# Altium schematic sheet acoplador_50_50.SchDoc
size A; SheetNumber: 2; SheetTotal: 2
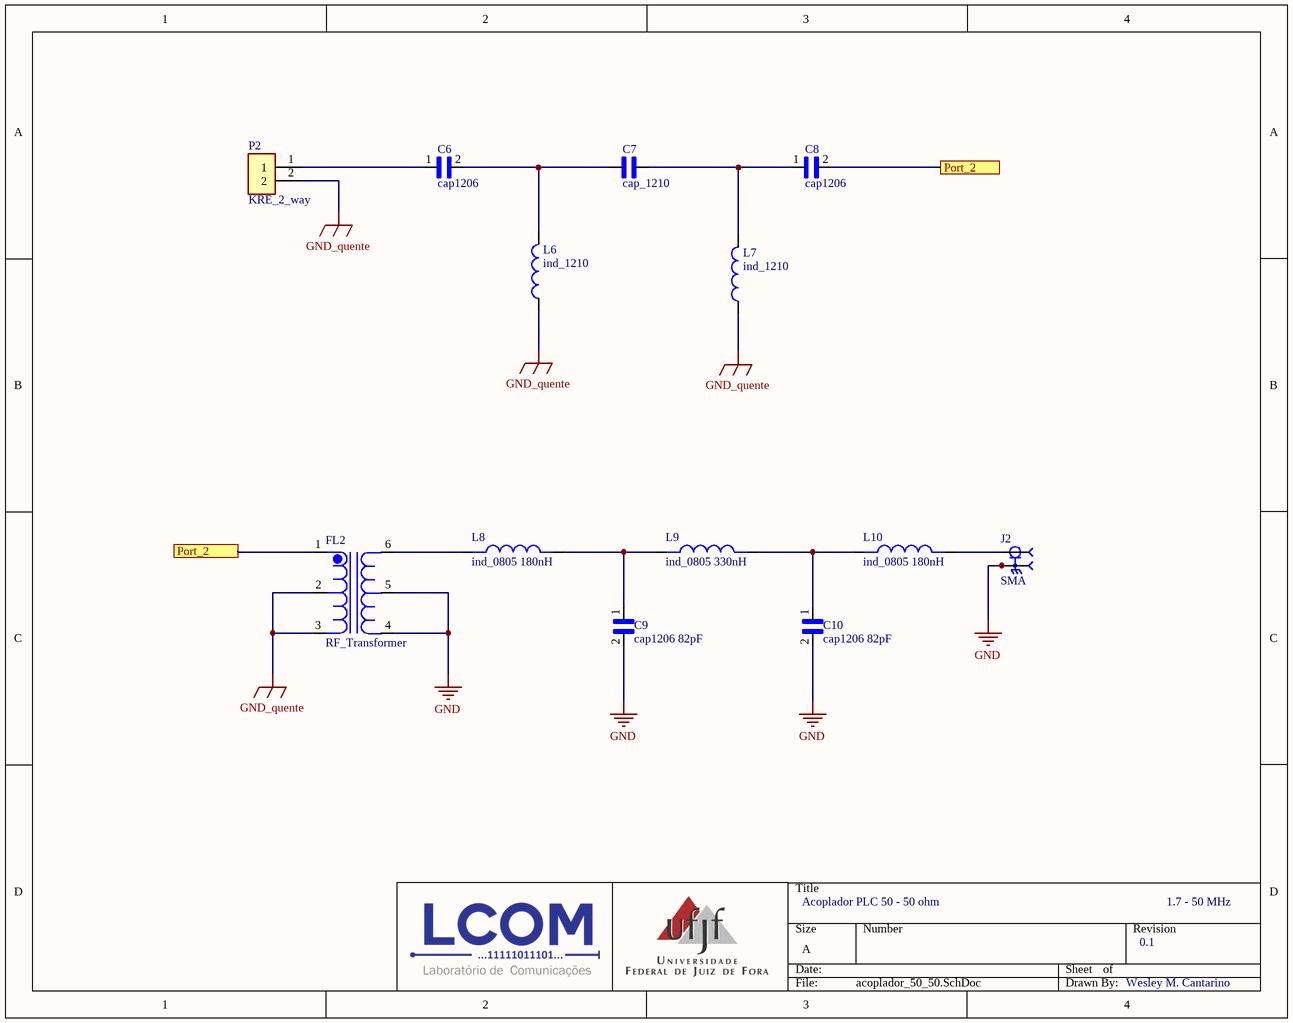
[diagram p0: acoplador_50_50.SchDoc]

## Parts
C6  cap1206  [CAPC3216X160N]
C7  cap_1210  [CAPC3225X200N]
C8  cap1206  [CAPC3216X160N]
C9  cap1206 82pF  [CAPC3216X160N]
C10  cap1206 82pF  [CAPC3216X160N]
FL2  RF_Transformer  [FIL_KA4909-AL]
J2  SMA  [JOHNSON_142-0701-201]
L6  ind_1210  [INDC3225X120N]
L7  ind_1210  [INDC3225X120N]
L8  ind_0805 180nH  [IND_ASMCI-0805-4R7M-T]
L9  ind_0805 330nH  [IND_ASMCI-0805-4R7M-T]
L10  ind_0805 180nH  [IND_ASMCI-0805-4R7M-T]
P2  KRE_2_way  [TE_282837-2]

## Ports
Port_2

## Nets
GND: C9.2 C10.2 FL2.4 FL2.5 J2.2 J2.3 J2.4 J2.5
GND_quente: FL2.2 FL2.3 L6.1 L7.1 P2.2
Port_2: C8.2 FL2.1 ; port Port_2
NetC6_1: C6.1 P2.1
NetC6_2: C6.2 C7.1 L6.2
NetC7_2: C7.2 C8.1 L7.2
NetC9_1: C9.1 L8.2 L9.1
NetC10_1: C10.1 L9.2 L10.1
NetFL2_6: FL2.6 L8.1
NetJ2_1: J2.1 L10.2

## Notes on the sheet
- Acoplador PLC 50 - 50 ohm
- 1.7 - 50 MHz
- 0.1
- Wesley M. Cantarino

## Library data of the parts
C6 C8-C10 = cap1206: MF: {'manufacturer': u'Syfer'}; MP: 1206J2K00820JCT; Package: None; Availability: Unavailable; Value: *; Price: None
C7 = cap_1210: CAPACITOR, X7T, 33NF; Capacitance:33000pF; Capacitance Tolerance:Â± 10%; Dielectric Characteristic:X7T; Voltage Rating:630V; Capacitor Case Style:1210 [3225 Metric]; Operating Temperature Min:-55Â°C; Operating Temperature Max:125Â°C; Packaging:Cut Tape; SVHC:No SVHC (19-Dec-2012); Capacitor Terminals:SMD; Operating Temperature Range:-55Â°C to +125Â°C; MF: {'manufacturer': u'Murata Electronics'}; MP: GR332DD72J333KW01L; Package: None; Availability: Unavailable; Value: *; Price: None
FL2 = RF_Transformer: Bias Injection Choke PWB 1.5 AL 30k 300M 1:1.5; MF: {'manufacturer': u'Coilcraft'}; MP: KA4909-AL; Package: None; Availability: Unavailable; Value: *; Price: None
J2 = SMA: Johnson Components 142-0701-201 / Conn Recept Straight Pcb .155""; MF: {'manufacturer': u'Cinch Connectivity Solutions Johnson'}; Package: None; Availability: Unavailable; Value: *; MP: 142-0701-201; Price: None
L6 L7 = ind_1210: Ind Metal Alloy Shielded 1.5uH 20% 1MHz Powdered Iron 2.6A 1210 T/R; MP: 1277AS-H-1R5M=P2; MF: {'manufacturer': u'Murata Electronics'}; Value: *; Package: None; Availability: Unavailable; Price: None
L8-L10 = ind_0805: MF: {'manufacturer': u'Abracon'}; MP: ASMCI-0805-4R7M-T; Package: None; Availability: Unavailable; Value: *; Price: None
P2 = KRE_2_way: TERM BLOCK 5.08MM 2POS SIDE ENTY; MP: 282837-2; MF: {'manufacturer': u'TE Connectivity'}; Value: *; Package: None; Availability: Unavailable; Price: None